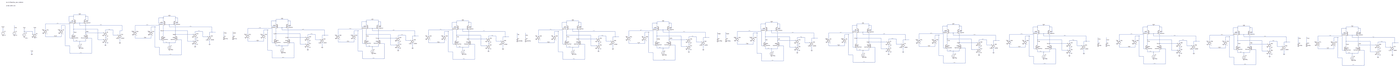
[diagram p0: schematic GmCMaxFlatTrans.asc, whole sheet]
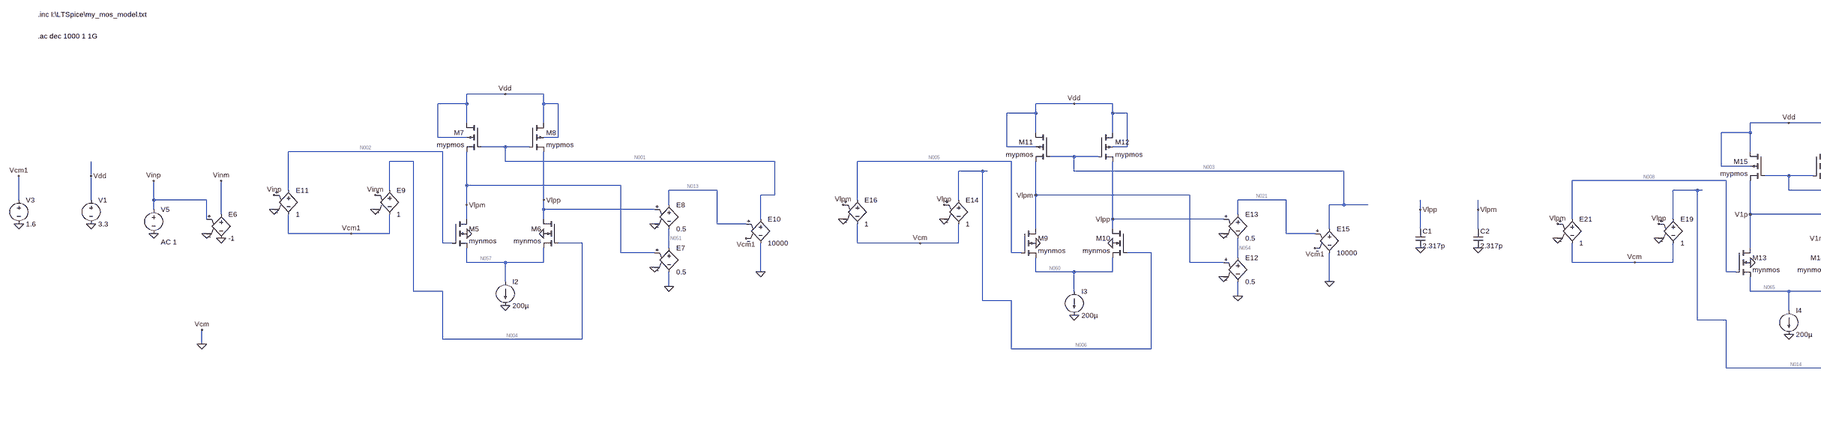
[diagram p1: schematic GmCMaxFlatTrans.asc, part, row 1 of 1, column 1 of 5]
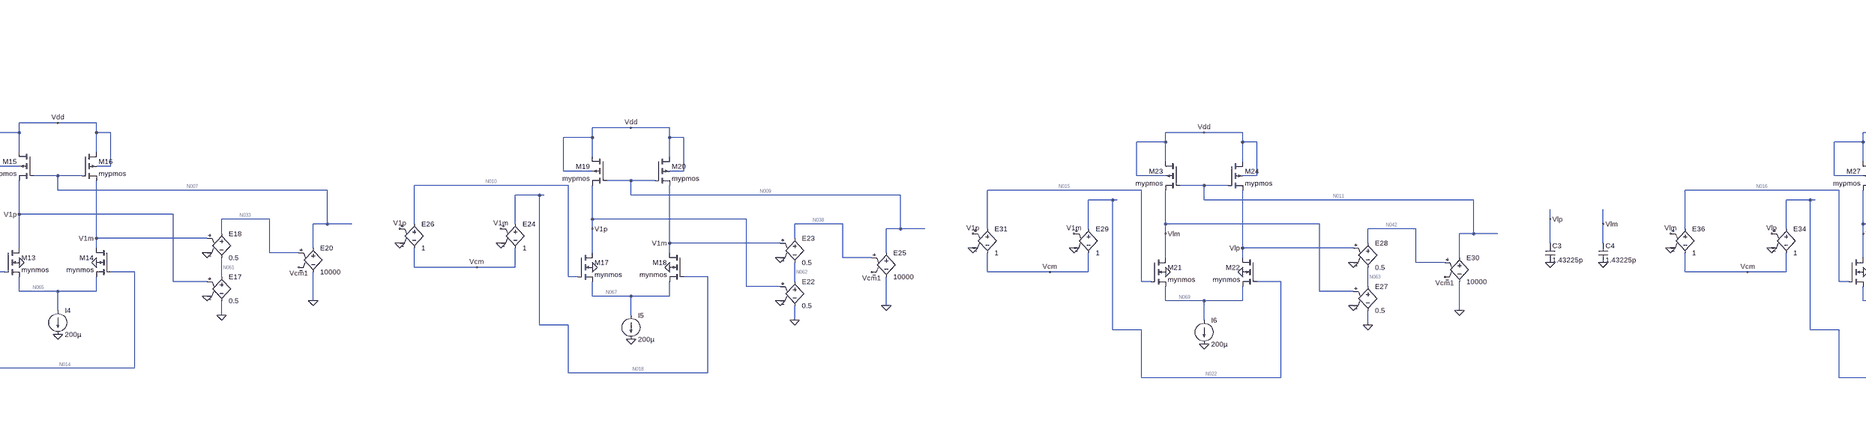
[diagram p2: schematic GmCMaxFlatTrans.asc, part, row 1 of 1, column 2 of 5]
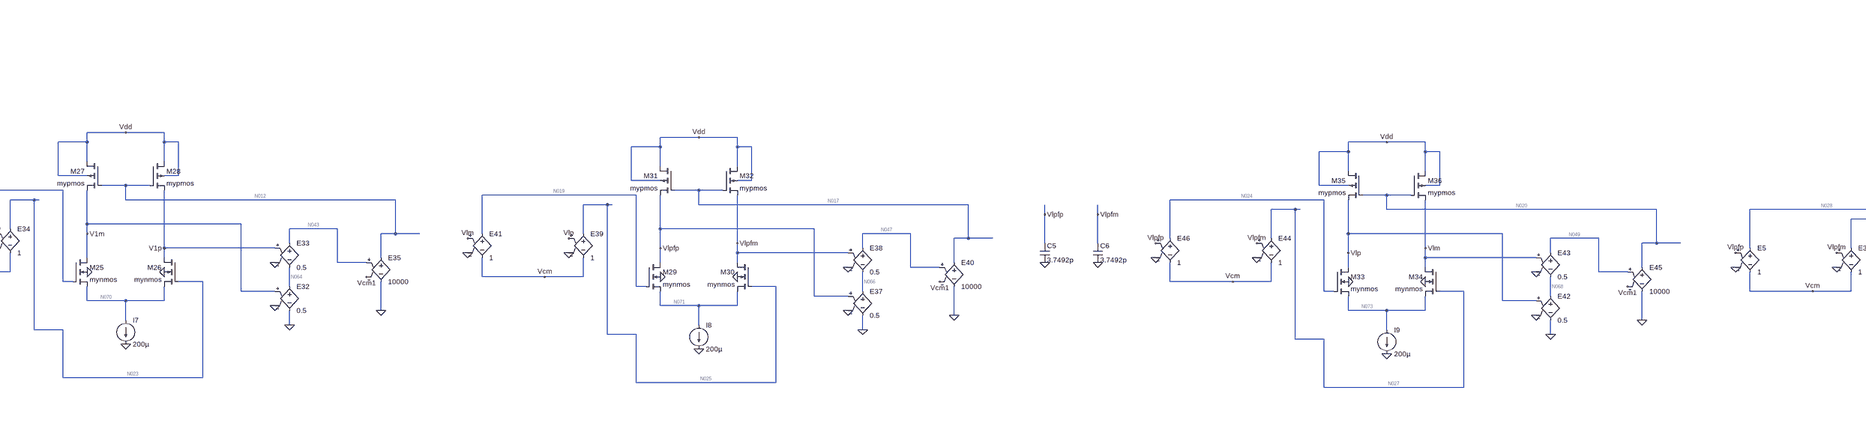
[diagram p3: schematic GmCMaxFlatTrans.asc, part, row 1 of 1, column 3 of 5]
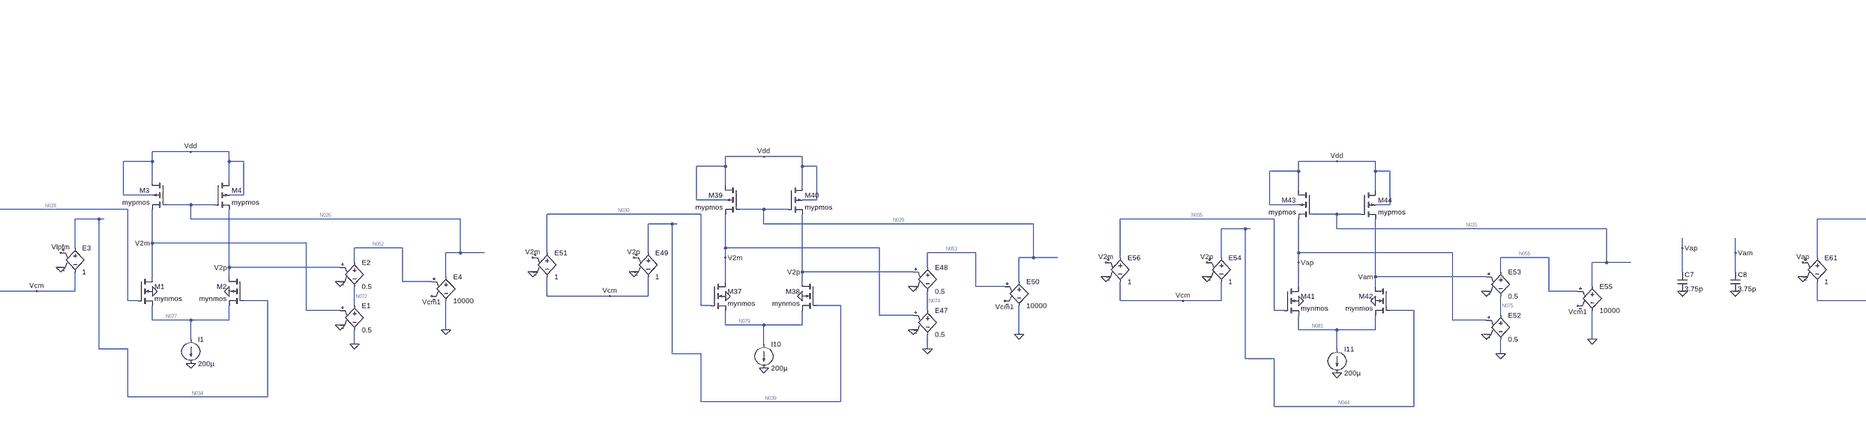
[diagram p4: schematic GmCMaxFlatTrans.asc, part, row 1 of 1, column 4 of 5]
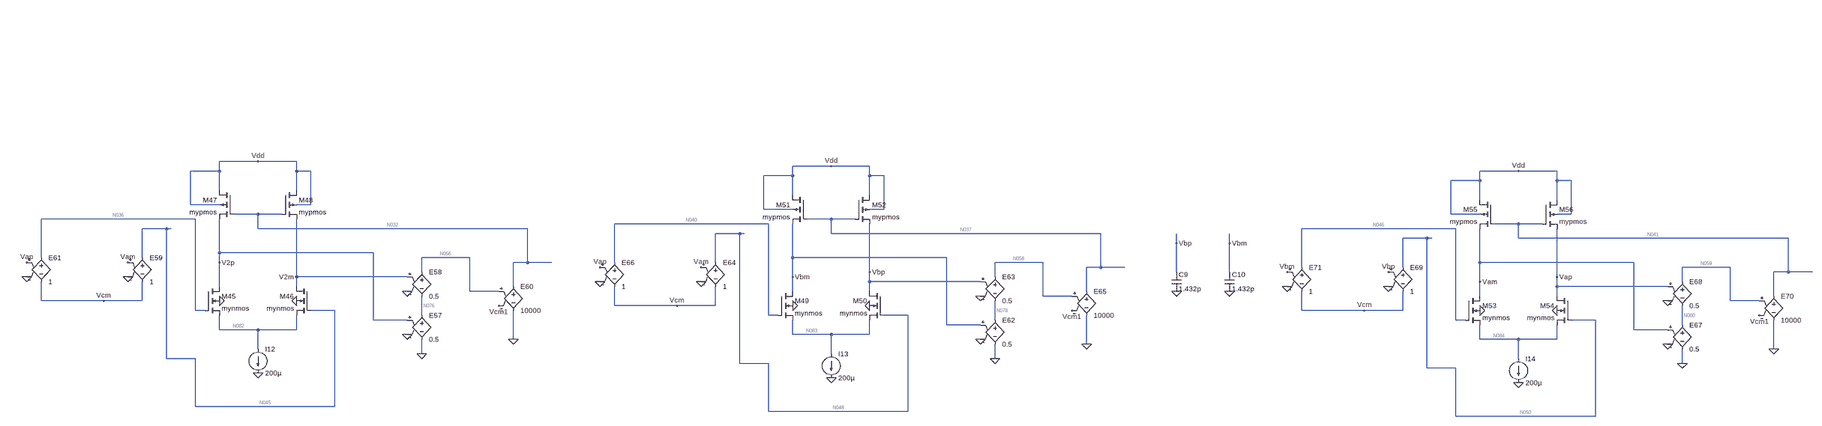
[diagram p5: schematic GmCMaxFlatTrans.asc, part, row 1 of 1, column 5 of 5]
GmCMaxFlatTrans.asc, the LTspice schematic file:
Version 4
SHEET 1 27508 2948
WIRE -672 -288 -800 -288
WIRE -544 -288 -672 -288
WIRE -800 -256 -800 -288
WIRE -800 -256 -896 -256
WIRE -544 -256 -544 -288
WIRE -496 -256 -544 -256
WIRE 1248 -256 1120 -256
WIRE 1376 -256 1248 -256
WIRE 1120 -224 1120 -256
WIRE 1120 -224 1024 -224
WIRE 1376 -224 1376 -256
WIRE 1424 -224 1376 -224
WIRE -800 -192 -800 -256
WIRE -544 -192 -544 -256
WIRE 3744 -192 3616 -192
WIRE 3872 -192 3744 -192
WIRE 5648 -176 5520 -176
WIRE 5776 -176 5648 -176
WIRE 1120 -160 1120 -224
WIRE 1376 -160 1376 -224
WIRE 3616 -160 3616 -192
WIRE 3616 -160 3520 -160
WIRE 3872 -160 3872 -192
WIRE 3920 -160 3872 -160
WIRE 7552 -160 7424 -160
WIRE 7680 -160 7552 -160
WIRE 9952 -160 9824 -160
WIRE 10080 -160 9952 -160
WIRE -896 -144 -896 -256
WIRE -800 -144 -896 -144
WIRE -496 -144 -496 -256
WIRE -496 -144 -544 -144
WIRE 5520 -144 5520 -176
WIRE 5520 -144 5424 -144
WIRE 5776 -144 5776 -176
WIRE 5824 -144 5776 -144
WIRE 11856 -144 11728 -144
WIRE 11984 -144 11856 -144
WIRE 7424 -128 7424 -160
WIRE 7424 -128 7328 -128
WIRE 7680 -128 7680 -160
WIRE 7728 -128 7680 -128
WIRE 9824 -128 9824 -160
WIRE 9824 -128 9728 -128
WIRE 10080 -128 10080 -160
WIRE 10128 -128 10080 -128
WIRE 14144 -128 14016 -128
WIRE 14272 -128 14144 -128
WIRE -672 -112 -752 -112
WIRE -592 -112 -672 -112
WIRE 1024 -112 1024 -224
WIRE 1120 -112 1024 -112
WIRE 1424 -112 1424 -224
WIRE 1424 -112 1376 -112
WIRE 11728 -112 11728 -144
WIRE 11728 -112 11632 -112
WIRE 11984 -112 11984 -144
WIRE 12032 -112 11984 -112
WIRE -880 -96 -1392 -96
WIRE 3616 -96 3616 -160
WIRE 3872 -96 3872 -160
WIRE 14016 -96 14016 -128
WIRE 14016 -96 13920 -96
WIRE 14272 -96 14272 -128
WIRE 14320 -96 14272 -96
WIRE 16128 -96 16000 -96
WIRE 16256 -96 16128 -96
WIRE 1248 -80 1168 -80
WIRE 1328 -80 1248 -80
WIRE 5520 -80 5520 -144
WIRE 5776 -80 5776 -144
WIRE 18032 -80 17904 -80
WIRE 18160 -80 18032 -80
WIRE -976 -64 -1056 -64
WIRE -672 -64 -672 -112
WIRE 224 -64 -672 -64
WIRE 1040 -64 528 -64
WIRE 7424 -64 7424 -128
WIRE 7680 -64 7680 -128
WIRE 9824 -64 9824 -128
WIRE 10080 -64 10080 -128
WIRE 16000 -64 16000 -96
WIRE 16000 -64 15904 -64
WIRE 16256 -64 16256 -96
WIRE 16304 -64 16256 -64
WIRE 19936 -64 19808 -64
WIRE 20064 -64 19936 -64
WIRE 22336 -64 22208 -64
WIRE 22464 -64 22336 -64
WIRE 3520 -48 3520 -160
WIRE 3616 -48 3520 -48
WIRE 3920 -48 3920 -160
WIRE 3920 -48 3872 -48
WIRE 11728 -48 11728 -112
WIRE 11984 -48 11984 -112
WIRE 17904 -48 17904 -80
WIRE 17904 -48 17808 -48
WIRE 18160 -48 18160 -80
WIRE 18208 -48 18160 -48
WIRE 24240 -48 24112 -48
WIRE 24368 -48 24240 -48
WIRE 944 -32 864 -32
WIRE 960 -32 944 -32
WIRE 1248 -32 1248 -80
WIRE 2144 -32 1248 -32
WIRE 5424 -32 5424 -144
WIRE 5520 -32 5424 -32
WIRE 5824 -32 5824 -144
WIRE 5824 -32 5776 -32
WIRE 14016 -32 14016 -96
WIRE 14272 -32 14272 -96
WIRE 19808 -32 19808 -64
WIRE 19808 -32 19712 -32
WIRE 20064 -32 20064 -64
WIRE 20112 -32 20064 -32
WIRE 22208 -32 22208 -64
WIRE 22208 -32 22112 -32
WIRE 22464 -32 22464 -64
WIRE 22512 -32 22464 -32
WIRE 26528 -32 26400 -32
WIRE 26656 -32 26528 -32
WIRE -2048 -16 -2048 -64
WIRE 3744 -16 3664 -16
WIRE 3824 -16 3744 -16
WIRE 7328 -16 7328 -128
WIRE 7424 -16 7328 -16
WIRE 7728 -16 7728 -128
WIRE 7728 -16 7680 -16
WIRE 9728 -16 9728 -128
WIRE 9824 -16 9728 -16
WIRE 10128 -16 10128 -128
WIRE 10128 -16 10080 -16
WIRE 24112 -16 24112 -48
WIRE 24112 -16 24016 -16
WIRE 24368 -16 24368 -48
WIRE 24416 -16 24368 -16
WIRE 3536 0 3024 0
WIRE 5648 0 5568 0
WIRE 5728 0 5648 0
WIRE 11632 0 11632 -112
WIRE 11728 0 11632 0
WIRE 12032 0 12032 -112
WIRE 12032 0 11984 0
WIRE 16000 0 16000 -64
WIRE 16256 0 16256 -64
WIRE 26400 0 26400 -32
WIRE 26400 0 26304 0
WIRE 26656 0 26656 -32
WIRE 26704 0 26656 0
WIRE -800 16 -800 -96
WIRE -288 16 -800 16
WIRE 5440 16 4928 16
WIRE 7552 16 7472 16
WIRE 7632 16 7552 16
WIRE 9952 16 9872 16
WIRE 10032 16 9952 16
WIRE 13920 16 13920 -96
WIRE 14016 16 13920 16
WIRE 14320 16 14320 -96
WIRE 14320 16 14272 16
WIRE 17904 16 17904 -48
WIRE 18160 16 18160 -48
WIRE -1392 32 -1392 -96
WIRE -1056 32 -1056 -64
WIRE 32 32 -128 32
WIRE 3440 32 3360 32
WIRE 3456 32 3440 32
WIRE 3744 32 3744 -16
WIRE 4640 32 3744 32
WIRE 7344 32 6832 32
WIRE 9744 32 9232 32
WIRE 11856 32 11776 32
WIRE 11936 32 11856 32
WIRE 19808 32 19808 -32
WIRE 20064 32 20064 -32
WIRE 22208 32 22208 -32
WIRE 22464 32 22464 -32
WIRE 224 48 224 -64
WIRE 224 48 176 48
WIRE 1120 48 1120 -64
WIRE 1632 48 1120 48
WIRE 5344 48 5264 48
WIRE 5360 48 5344 48
WIRE 5648 48 5648 0
WIRE 6544 48 5648 48
WIRE 11648 48 11136 48
WIRE 14144 48 14064 48
WIRE 14224 48 14144 48
WIRE 15904 48 15904 -64
WIRE 16000 48 15904 48
WIRE 16304 48 16304 -64
WIRE 16304 48 16256 48
WIRE 24112 48 24112 -16
WIRE 24368 48 24368 -16
WIRE -2288 64 -2288 -16
WIRE -2048 64 -2048 -16
WIRE -1840 64 -1840 0
WIRE -1664 64 -1840 64
WIRE -544 64 -544 -96
WIRE 528 64 528 -64
WIRE 864 64 864 -32
WIRE 1952 64 1792 64
WIRE 7248 64 7168 64
WIRE 7264 64 7248 64
WIRE 7552 64 7552 16
WIRE 8448 64 7552 64
WIRE 9648 64 9568 64
WIRE 9664 64 9648 64
WIRE 9952 64 9952 16
WIRE 10848 64 9952 64
WIRE 13936 64 13424 64
WIRE 17808 64 17808 -48
WIRE 17904 64 17808 64
WIRE 18208 64 18208 -48
WIRE 18208 64 18160 64
WIRE 26400 64 26400 0
WIRE 26656 64 26656 0
WIRE -800 80 -800 16
WIRE -128 80 -128 32
WIRE 2144 80 2144 -32
WIRE 2144 80 2096 80
WIRE 2224 80 2144 80
WIRE 11552 80 11472 80
WIRE 11568 80 11552 80
WIRE 11856 80 11856 32
WIRE 12752 80 11856 80
WIRE 16128 80 16048 80
WIRE 16208 80 16128 80
WIRE 19712 80 19712 -32
WIRE 19808 80 19712 80
WIRE 20112 80 20112 -32
WIRE 20112 80 20064 80
WIRE 22112 80 22112 -32
WIRE 22208 80 22112 80
WIRE 22512 80 22512 -32
WIRE 22512 80 22464 80
WIRE -1840 96 -1840 64
WIRE -544 96 -544 64
WIRE -176 96 -544 96
WIRE 2480 96 2480 64
WIRE 2672 96 2672 64
WIRE 13840 96 13760 96
WIRE 13856 96 13840 96
WIRE 14144 96 14144 48
WIRE 15040 96 14144 96
WIRE 15920 96 15408 96
WIRE 18032 96 17952 96
WIRE 18112 96 18032 96
WIRE 24016 96 24016 -16
WIRE 24112 96 24016 96
WIRE 24416 96 24416 -16
WIRE 24416 96 24368 96
WIRE -1616 112 -1616 0
WIRE 1792 112 1792 64
WIRE 3616 112 3616 0
WIRE 4128 112 3616 112
WIRE 13008 112 13008 80
WIRE 13184 112 13184 80
WIRE 17824 112 17312 112
WIRE 19936 112 19856 112
WIRE 20016 112 19936 112
WIRE 22336 112 22256 112
WIRE 22416 112 22336 112
WIRE 26304 112 26304 0
WIRE 26400 112 26304 112
WIRE 26704 112 26704 0
WIRE 26704 112 26656 112
WIRE -1664 128 -1664 64
WIRE -800 128 -800 80
WIRE -544 128 -544 96
WIRE 176 128 176 48
WIRE 1376 128 1376 -64
WIRE 1744 128 1376 128
WIRE 3024 128 3024 0
WIRE 3360 128 3360 32
WIRE 4448 128 4288 128
WIRE 5520 128 5520 16
WIRE 6032 128 5520 128
WIRE 8784 128 8784 96
WIRE 15824 128 15744 128
WIRE 15840 128 15824 128
WIRE 16128 128 16128 80
WIRE 17024 128 16128 128
WIRE 19728 128 19216 128
WIRE 22128 128 21616 128
WIRE 24240 128 24160 128
WIRE 24320 128 24240 128
WIRE 32 144 32 32
WIRE 128 144 32 144
WIRE 4640 144 4640 32
WIRE 4640 144 4592 144
WIRE 4720 144 4640 144
WIRE 4928 144 4928 16
WIRE 5264 144 5264 48
WIRE 6352 144 6192 144
WIRE 7424 144 7424 32
WIRE 7936 144 7424 144
WIRE 8960 144 8960 96
WIRE 9824 144 9824 32
WIRE 10336 144 9824 144
WIRE 17728 144 17648 144
WIRE 17744 144 17728 144
WIRE 18032 144 18032 96
WIRE 18928 144 18032 144
WIRE 24032 144 23520 144
WIRE 26528 144 26448 144
WIRE 26608 144 26528 144
WIRE 1120 160 1120 48
WIRE 1376 160 1376 128
WIRE 2096 160 2096 80
WIRE 2480 160 2480 96
WIRE 2672 160 2672 96
WIRE 5520 160 5520 128
WIRE 6544 160 6544 48
WIRE 6544 160 6496 160
WIRE 6624 160 6544 160
WIRE 6832 160 6832 32
WIRE 7168 160 7168 64
WIRE 8256 160 8096 160
WIRE 9232 160 9232 32
WIRE 9568 160 9568 64
WIRE 10656 160 10496 160
WIRE 11728 160 11728 48
WIRE 12240 160 11728 160
WIRE 19632 160 19552 160
WIRE 19648 160 19632 160
WIRE 19936 160 19936 112
WIRE 20832 160 19936 160
WIRE 22032 160 21952 160
WIRE 22048 160 22032 160
WIRE 22336 160 22336 112
WIRE 23232 160 22336 160
WIRE 26320 160 25808 160
WIRE -1392 176 -1392 112
WIRE -1184 176 -1392 176
WIRE -1056 176 -1056 112
WIRE -1056 176 -1184 176
WIRE 1952 176 1952 64
WIRE 2048 176 1952 176
WIRE 4288 176 4288 128
WIRE 7424 176 7424 144
WIRE 8448 176 8448 64
WIRE 8448 176 8400 176
WIRE 8528 176 8448 176
WIRE 9824 176 9824 144
WIRE 10848 176 10848 64
WIRE 10848 176 10800 176
WIRE 10928 176 10848 176
WIRE 11136 176 11136 48
WIRE 11472 176 11472 80
WIRE 12560 176 12400 176
WIRE 14016 176 14016 64
WIRE 14528 176 14016 176
WIRE 23936 176 23856 176
WIRE 23952 176 23936 176
WIRE 24240 176 24240 128
WIRE 25136 176 24240 176
WIRE 3872 192 3872 0
WIRE 4240 192 3872 192
WIRE 6192 192 6192 144
WIRE 12752 192 12752 80
WIRE 12752 192 12704 192
WIRE 12832 192 12752 192
WIRE 13424 192 13424 64
WIRE 13760 192 13760 96
WIRE 14848 192 14688 192
WIRE 26224 192 26144 192
WIRE 26240 192 26224 192
WIRE 26528 192 26528 144
WIRE 27424 192 26528 192
WIRE -880 208 -880 -96
WIRE -848 208 -880 208
WIRE -416 208 -496 208
WIRE 528 208 528 144
WIRE 736 208 528 208
WIRE 864 208 864 144
WIRE 864 208 736 208
WIRE 5776 208 5776 16
WIRE 6144 208 5776 208
WIRE 8096 208 8096 160
WIRE 8784 208 8784 128
WIRE 8960 208 8960 144
WIRE 10496 208 10496 160
WIRE 11984 208 11984 48
WIRE 13008 208 13008 112
WIRE 13184 208 13184 112
WIRE 15040 208 15040 96
WIRE 15040 208 14992 208
WIRE 15120 208 15040 208
WIRE 16000 208 16000 96
WIRE 16512 208 16000 208
WIRE 25392 208 25392 176
WIRE 25568 208 25568 176
WIRE -128 224 -128 160
WIRE 3616 224 3616 112
WIRE 3872 224 3872 192
WIRE 4592 224 4592 144
WIRE 7680 224 7680 32
WIRE 8048 224 7680 224
WIRE 10080 224 10080 32
WIRE 10448 224 10080 224
WIRE 11728 224 11728 160
WIRE 12400 224 12400 176
WIRE 14272 224 14272 64
WIRE 15408 224 15408 96
WIRE 15744 224 15744 128
WIRE 16832 224 16672 224
WIRE 17904 224 17904 112
WIRE 18416 224 17904 224
WIRE 21168 224 21168 192
WIRE -288 240 -288 16
WIRE -176 240 -288 240
WIRE 1040 240 1040 -64
WIRE 1072 240 1040 240
WIRE 1504 240 1424 240
WIRE 4448 240 4448 128
WIRE 4544 240 4448 240
WIRE 5520 240 5520 160
WIRE 5776 240 5776 208
WIRE 6496 240 6496 160
WIRE 11984 240 11984 208
WIRE 12352 240 11984 240
WIRE 14016 240 14016 176
WIRE 14688 240 14688 192
WIRE 17024 240 17024 128
WIRE 17024 240 16976 240
WIRE 17104 240 17024 240
WIRE 17312 240 17312 112
WIRE 17648 240 17648 144
WIRE 18736 240 18576 240
WIRE 19808 240 19808 128
WIRE 20320 240 19808 240
WIRE 21344 240 21344 192
WIRE 22208 240 22208 128
WIRE 22720 240 22208 240
WIRE 1792 256 1792 192
WIRE 6352 256 6352 144
WIRE 6448 256 6352 256
WIRE 7424 256 7424 176
WIRE 7680 256 7680 224
WIRE 8400 256 8400 176
WIRE 9824 256 9824 176
WIRE 10080 256 10080 224
WIRE 10800 256 10800 176
WIRE 14272 256 14272 224
WIRE 14640 256 14272 256
WIRE 17904 256 17904 224
WIRE 18928 256 18928 144
WIRE 18928 256 18880 256
WIRE 19008 256 18928 256
WIRE 19216 256 19216 128
WIRE 19552 256 19552 160
WIRE 20640 256 20480 256
WIRE 21616 256 21616 128
WIRE 21952 256 21952 160
WIRE 23040 256 22880 256
WIRE 24112 256 24112 144
WIRE 24624 256 24112 256
WIRE -800 272 -800 224
WIRE -672 272 -800 272
WIRE -544 272 -544 224
WIRE -544 272 -672 272
WIRE 1632 272 1632 48
WIRE 1744 272 1632 272
WIRE 3024 272 3024 208
WIRE 3232 272 3024 272
WIRE 3360 272 3360 208
WIRE 3360 272 3232 272
WIRE 8256 272 8256 160
WIRE 8352 272 8256 272
WIRE 10656 272 10656 160
WIRE 10752 272 10656 272
WIRE 11728 272 11728 224
WIRE 11984 272 11984 240
WIRE 12704 272 12704 192
WIRE 16672 272 16672 224
WIRE 19808 272 19808 240
WIRE 20832 272 20832 160
WIRE 20832 272 20784 272
WIRE 20912 272 20832 272
WIRE 22208 272 22208 240
WIRE 23232 272 23232 160
WIRE 23232 272 23184 272
WIRE 23312 272 23232 272
WIRE 23520 272 23520 144
WIRE 23856 272 23856 176
WIRE 24944 272 24784 272
WIRE 26400 272 26400 160
WIRE 26912 272 26400 272
WIRE 4928 288 4928 224
WIRE 5136 288 4928 288
WIRE 5264 288 5264 224
WIRE 5264 288 5136 288
WIRE 12560 288 12560 176
WIRE 12656 288 12560 288
WIRE 14016 288 14016 240
WIRE 14272 288 14272 256
WIRE 14992 288 14992 208
WIRE 16256 288 16256 96
WIRE 16624 288 16256 288
WIRE 18576 288 18576 240
WIRE 25136 288 25136 176
WIRE 25136 288 25088 288
WIRE 25216 288 25136 288
WIRE 25808 288 25808 160
WIRE 26144 288 26144 192
WIRE 27232 288 27072 288
WIRE 176 304 176 208
WIRE 1120 304 1120 256
WIRE 1248 304 1120 304
WIRE 1376 304 1376 256
WIRE 1376 304 1248 304
WIRE 3536 304 3536 0
WIRE 3568 304 3536 304
WIRE 4000 304 3920 304
WIRE 6832 304 6832 240
WIRE 7040 304 6832 304
WIRE 7168 304 7168 240
WIRE 7168 304 7040 304
WIRE 9232 304 9232 240
WIRE 9440 304 9232 304
WIRE 9568 304 9568 240
WIRE 9568 304 9440 304
WIRE 14848 304 14848 192
WIRE 14944 304 14848 304
WIRE 18160 304 18160 112
WIRE 18528 304 18160 304
WIRE 20480 304 20480 256
WIRE 21168 304 21168 224
WIRE 21344 304 21344 240
WIRE 22880 304 22880 256
WIRE 24368 304 24368 144
WIRE 25392 304 25392 208
WIRE 25568 304 25568 208
WIRE 27424 304 27424 192
WIRE 27424 304 27376 304
WIRE 27504 304 27424 304
WIRE 4288 320 4288 256
WIRE 5440 320 5440 16
WIRE 5472 320 5440 320
WIRE 5904 320 5824 320
WIRE 11136 320 11136 256
WIRE 11344 320 11136 320
WIRE 11472 320 11472 256
WIRE 11472 320 11344 320
WIRE 16000 320 16000 208
WIRE 16256 320 16256 288
WIRE 16976 320 16976 240
WIRE 20064 320 20064 128
WIRE 20432 320 20064 320
WIRE 22464 320 22464 128
WIRE 22832 320 22464 320
WIRE 24112 320 24112 256
WIRE 24784 320 24784 272
WIRE 26656 320 26656 160
WIRE -672 336 -672 272
WIRE 2096 336 2096 240
WIRE 4128 336 4128 112
WIRE 4240 336 4128 336
WIRE 6192 336 6192 272
WIRE 7344 336 7344 32
WIRE 7376 336 7344 336
WIRE 7808 336 7728 336
WIRE 9744 336 9744 32
WIRE 9776 336 9744 336
WIRE 10208 336 10128 336
WIRE 13424 336 13424 272
WIRE 13632 336 13424 336
WIRE 13760 336 13760 272
WIRE 13760 336 13632 336
WIRE 16832 336 16832 224
WIRE 16928 336 16832 336
WIRE 17904 336 17904 256
WIRE 18160 336 18160 304
WIRE 18880 336 18880 256
WIRE 24368 336 24368 304
WIRE 24736 336 24368 336
WIRE 26400 336 26400 272
WIRE 27072 336 27072 288
WIRE -128 352 -128 304
WIRE 6032 352 6032 128
WIRE 6144 352 6032 352
WIRE 8096 352 8096 288
WIRE 10496 352 10496 288
WIRE 11648 352 11648 48
WIRE 11680 352 11648 352
WIRE 12112 352 12032 352
WIRE 18736 352 18736 240
WIRE 18832 352 18736 352
WIRE 19808 352 19808 272
WIRE 20064 352 20064 320
WIRE 20784 352 20784 272
WIRE 22208 352 22208 272
WIRE 22464 352 22464 320
WIRE 23184 352 23184 272
WIRE 26656 352 26656 320
WIRE 27024 352 26656 352
WIRE -976 368 -976 -64
WIRE -880 368 -976 368
WIRE 1248 368 1248 304
WIRE 3616 368 3616 320
WIRE 3744 368 3616 368
WIRE 3872 368 3872 320
WIRE 3872 368 3744 368
WIRE 7936 368 7936 144
WIRE 8048 368 7936 368
WIRE 10336 368 10336 144
WIRE 10448 368 10336 368
WIRE 12400 368 12400 304
WIRE 13936 368 13936 64
WIRE 13968 368 13936 368
WIRE 14400 368 14320 368
WIRE 15408 368 15408 304
WIRE 15616 368 15408 368
WIRE 15744 368 15744 304
WIRE 15744 368 15616 368
WIRE 20640 368 20640 256
WIRE 20736 368 20640 368
WIRE 23040 368 23040 256
WIRE 23136 368 23040 368
WIRE 24112 368 24112 320
WIRE 24368 368 24368 336
WIRE 25088 368 25088 288
WIRE 1792 384 1792 336
WIRE 5520 384 5520 336
WIRE 5648 384 5520 384
WIRE 5776 384 5776 336
WIRE 5776 384 5648 384
WIRE 12240 384 12240 160
WIRE 12352 384 12240 384
WIRE 14688 384 14688 320
WIRE 17312 384 17312 320
WIRE 17520 384 17312 384
WIRE 17648 384 17648 320
WIRE 17648 384 17520 384
WIRE 24944 384 24944 272
WIRE 25040 384 24944 384
WIRE 26400 384 26400 336
WIRE 26656 384 26656 352
WIRE 27376 384 27376 304
WIRE 944 400 944 -32
WIRE 1040 400 944 400
WIRE 4592 400 4592 304
WIRE 7424 400 7424 352
WIRE 7552 400 7424 400
WIRE 7680 400 7680 352
WIRE 7680 400 7552 400
WIRE 9824 400 9824 352
WIRE 9952 400 9824 400
WIRE 10080 400 10080 352
WIRE 10080 400 9952 400
WIRE 14528 400 14528 176
WIRE 14640 400 14528 400
WIRE 15920 400 15920 96
WIRE 15952 400 15920 400
WIRE 16384 400 16304 400
WIRE 19216 400 19216 336
WIRE 19424 400 19216 400
WIRE 19552 400 19552 336
WIRE 19552 400 19424 400
WIRE 21616 400 21616 336
WIRE 21824 400 21616 400
WIRE 21952 400 21952 336
WIRE 21952 400 21824 400
WIRE 27232 400 27232 288
WIRE 27328 400 27232 400
WIRE 6496 416 6496 320
WIRE 11728 416 11728 368
WIRE 11856 416 11728 416
WIRE 11984 416 11984 368
WIRE 11984 416 11856 416
WIRE 16672 416 16672 352
WIRE 17824 416 17824 112
WIRE 17856 416 17824 416
WIRE 18288 416 18208 416
WIRE 23520 416 23520 352
WIRE 23728 416 23520 416
WIRE 23856 416 23856 352
WIRE 23856 416 23728 416
WIRE 3744 432 3744 368
WIRE 8400 432 8400 336
WIRE 10800 432 10800 336
WIRE 14016 432 14016 384
WIRE 14144 432 14016 432
WIRE 14272 432 14272 384
WIRE 14272 432 14144 432
WIRE 16512 432 16512 208
WIRE 16624 432 16512 432
WIRE 18576 432 18576 368
WIRE 19728 432 19728 128
WIRE 19760 432 19728 432
WIRE 20192 432 20112 432
WIRE 22128 432 22128 128
WIRE 22160 432 22128 432
WIRE 22592 432 22512 432
WIRE 25808 432 25808 368
WIRE 26016 432 25808 432
WIRE 26144 432 26144 368
WIRE 26144 432 26016 432
WIRE 4288 448 4288 400
WIRE 5648 448 5648 384
WIRE 12704 448 12704 352
WIRE 18416 448 18416 224
WIRE 18528 448 18416 448
WIRE 20480 448 20480 384
WIRE 22880 448 22880 384
WIRE 24032 448 24032 144
WIRE 24064 448 24032 448
WIRE 24496 448 24416 448
WIRE 3440 464 3440 32
WIRE 3536 464 3440 464
WIRE 6192 464 6192 416
WIRE 7552 464 7552 400
WIRE 9952 464 9952 400
WIRE 14992 464 14992 368
WIRE 16000 464 16000 416
WIRE 16128 464 16000 464
WIRE 16256 464 16256 416
WIRE 16256 464 16128 464
WIRE 20320 464 20320 240
WIRE 20432 464 20320 464
WIRE 22720 464 22720 240
WIRE 22832 464 22720 464
WIRE 24784 464 24784 400
WIRE 26320 464 26320 160
WIRE 26352 464 26320 464
WIRE 26784 464 26704 464
WIRE 5344 480 5344 48
WIRE 5440 480 5344 480
WIRE 8096 480 8096 432
WIRE 10496 480 10496 432
WIRE 11856 480 11856 416
WIRE 17904 480 17904 432
WIRE 18032 480 17904 480
WIRE 18160 480 18160 432
WIRE 18160 480 18032 480
WIRE 24624 480 24624 256
WIRE 24736 480 24624 480
WIRE 27072 480 27072 416
WIRE 7248 496 7248 64
WIRE 7344 496 7248 496
WIRE 9648 496 9648 64
WIRE 9744 496 9648 496
WIRE 12400 496 12400 448
WIRE 14144 496 14144 432
WIRE 16976 496 16976 400
WIRE 19808 496 19808 448
WIRE 19936 496 19808 496
WIRE 20064 496 20064 448
WIRE 20064 496 19936 496
WIRE 22208 496 22208 448
WIRE 22336 496 22208 496
WIRE 22464 496 22464 448
WIRE 22464 496 22336 496
WIRE 26912 496 26912 272
WIRE 27024 496 26912 496
WIRE 11552 512 11552 80
WIRE 11648 512 11552 512
WIRE 14688 512 14688 464
WIRE 18880 512 18880 416
WIRE 24112 512 24112 464
WIRE 24240 512 24112 512
WIRE 24368 512 24368 464
WIRE 24368 512 24240 512
WIRE -880 528 -880 368
WIRE -416 528 -416 208
WIRE -416 528 -880 528
WIRE 13840 528 13840 96
WIRE 13936 528 13840 528
WIRE 16128 528 16128 464
WIRE 20784 528 20784 432
WIRE 23184 528 23184 432
WIRE 26400 528 26400 480
WIRE 26528 528 26400 528
WIRE 26656 528 26656 480
WIRE 26656 528 26528 528
WIRE -1680 544 -1680 496
WIRE 16672 544 16672 496
WIRE 18032 544 18032 480
WIRE 25088 544 25088 448
WIRE 1040 560 1040 400
WIRE 1504 560 1504 240
WIRE 1504 560 1040 560
WIRE 15824 560 15824 128
WIRE 15920 560 15824 560
WIRE 18576 560 18576 512
WIRE 19936 560 19936 496
WIRE 22336 560 22336 496
WIRE 27376 560 27376 464
WIRE 17728 576 17728 144
WIRE 17824 576 17728 576
WIRE 20480 576 20480 528
WIRE 22880 576 22880 528
WIRE 24240 576 24240 512
WIRE 19632 592 19632 160
WIRE 19728 592 19632 592
WIRE 22032 592 22032 160
WIRE 22128 592 22032 592
WIRE 24784 592 24784 544
WIRE 26528 592 26528 528
WIRE 23936 608 23936 176
WIRE 24032 608 23936 608
WIRE 27072 608 27072 560
WIRE 3536 624 3536 464
WIRE 4000 624 4000 304
WIRE 4000 624 3536 624
WIRE 26224 624 26224 192
WIRE 26320 624 26224 624
WIRE 5440 640 5440 480
WIRE 5904 640 5904 320
WIRE 5904 640 5440 640
WIRE 7344 656 7344 496
WIRE 7808 656 7808 336
WIRE 7808 656 7344 656
WIRE 9744 656 9744 496
WIRE 10208 656 10208 336
WIRE 10208 656 9744 656
WIRE 11648 672 11648 512
WIRE 12112 672 12112 352
WIRE 12112 672 11648 672
WIRE 13936 688 13936 528
WIRE 14400 688 14400 368
WIRE 14400 688 13936 688
WIRE 15920 720 15920 560
WIRE 16384 720 16384 400
WIRE 16384 720 15920 720
WIRE 17824 736 17824 576
WIRE 18288 736 18288 416
WIRE 18288 736 17824 736
WIRE 19728 752 19728 592
WIRE 20192 752 20192 432
WIRE 20192 752 19728 752
WIRE 22128 752 22128 592
WIRE 22592 752 22592 432
WIRE 22592 752 22128 752
WIRE 24032 768 24032 608
WIRE 24496 768 24496 448
WIRE 24496 768 24032 768
WIRE 26320 784 26320 624
WIRE 26784 784 26784 464
WIRE 26784 784 26320 784
FLAG -1840 176 0
FLAG -1616 192 0
FLAG -1664 176 0
FLAG -1840 0 Vinp
FLAG -1616 0 Vinm
FLAG -672 -288 Vdd
FLAG -176 288 0
FLAG -176 144 0
FLAG -128 352 0
FLAG 176 304 0
FLAG -800 176 0
FLAG -544 176 0
FLAG 128 192 Vcm1
FLAG -672 416 0
FLAG -1440 96 0
FLAG -1104 96 0
FLAG -1440 48 Vinp
FLAG -1104 48 Vinm
FLAG -544 64 Vlpp
FLAG -800 80 Vlpm
FLAG 1248 -256 Vdd
FLAG 1744 320 0
FLAG 1744 176 0
FLAG 1792 384 0
FLAG 2096 336 0
FLAG 736 208 Vcm
FLAG 1120 208 0
FLAG 1376 208 0
FLAG 2048 224 Vcm1
FLAG 1248 448 0
FLAG 480 128 0
FLAG 816 128 0
FLAG 480 80 Vlpm
FLAG 816 80 Vlpp
FLAG 1120 48 Vlpm
FLAG 1376 128 Vlpp
FLAG 2480 224 0
FLAG 2480 96 Vlpp
FLAG 2672 224 0
FLAG 2672 96 Vlpm
FLAG 3744 -192 Vdd
FLAG 4240 384 0
FLAG 4240 240 0
FLAG 4288 448 0
FLAG 4592 400 0
FLAG 3232 272 Vcm
FLAG 3616 272 0
FLAG 3872 272 0
FLAG 4544 288 Vcm1
FLAG 3744 512 0
FLAG 2976 192 0
FLAG 3312 192 0
FLAG 2976 144 Vlpm
FLAG 3312 144 Vlpp
FLAG 3872 192 V1m
FLAG 3616 112 V1p
FLAG 5648 -176 Vdd
FLAG 6144 400 0
FLAG 6144 256 0
FLAG 6192 464 0
FLAG 6496 416 0
FLAG 5136 288 Vcm
FLAG 5520 288 0
FLAG 5776 288 0
FLAG 6448 304 Vcm1
FLAG 5648 528 0
FLAG 4880 208 0
FLAG 5216 208 0
FLAG 4880 160 V1p
FLAG 5216 160 V1m
FLAG 5520 160 V1p
FLAG 5776 208 V1m
FLAG 7552 -160 Vdd
FLAG 8048 416 0
FLAG 8048 272 0
FLAG 8096 480 0
FLAG 8400 432 0
FLAG 7040 304 Vcm
FLAG 7424 304 0
FLAG 7680 304 0
FLAG 8352 320 Vcm1
FLAG 7552 544 0
FLAG 6784 224 0
FLAG 7120 224 0
FLAG 6784 176 V1p
FLAG 7120 176 V1m
FLAG 7424 176 Vlm
FLAG 7680 224 Vlp
FLAG 8784 272 0
FLAG 8960 272 0
FLAG 8784 128 Vlp
FLAG 8960 144 Vlm
FLAG 9952 -160 Vdd
FLAG 10448 416 0
FLAG 10448 272 0
FLAG 10496 480 0
FLAG 10800 432 0
FLAG 9440 304 Vcm
FLAG 9824 304 0
FLAG 10080 304 0
FLAG 10752 320 Vcm1
FLAG 9952 544 0
FLAG 9184 224 0
FLAG 9520 224 0
FLAG 9824 176 V1m
FLAG 10080 224 V1p
FLAG 9184 176 Vlm
FLAG 9520 176 Vlp
FLAG 11856 -144 Vdd
FLAG 12352 432 0
FLAG 12352 288 0
FLAG 12400 496 0
FLAG 12704 448 0
FLAG 11344 320 Vcm
FLAG 11728 320 0
FLAG 11984 320 0
FLAG 12656 336 Vcm1
FLAG 11856 560 0
FLAG 11088 240 0
FLAG 11424 240 0
FLAG 11088 192 Vlm
FLAG 11424 192 Vlp
FLAG 11728 224 Vlpfp
FLAG 11984 208 Vlpfm
FLAG 13008 272 0
FLAG 13184 272 0
FLAG 13008 112 Vlpfp
FLAG 13184 112 Vlpfm
FLAG 14144 -128 Vdd
FLAG 14640 448 0
FLAG 14640 304 0
FLAG 14688 512 0
FLAG 14992 464 0
FLAG 13632 336 Vcm
FLAG 14016 336 0
FLAG 14272 336 0
FLAG 14944 352 Vcm1
FLAG 14144 576 0
FLAG 13376 256 0
FLAG 13712 256 0
FLAG 13376 208 Vlpfp
FLAG 13712 208 Vlpfm
FLAG 14016 240 Vlp
FLAG 14272 224 Vlm
FLAG -2048 144 0
FLAG -2048 -16 Vdd
FLAG -2288 144 0
FLAG -1680 544 0
FLAG -1680 496 Vcm
FLAG -1184 176 Vcm1
FLAG -2288 -16 Vcm1
FLAG 16128 -96 Vdd
FLAG 16624 480 0
FLAG 16624 336 0
FLAG 16672 544 0
FLAG 16976 496 0
FLAG 15616 368 Vcm
FLAG 16000 368 0
FLAG 16256 368 0
FLAG 16928 384 Vcm1
FLAG 16128 608 0
FLAG 15360 288 0
FLAG 15696 288 0
FLAG 15360 240 Vlpfp
FLAG 15696 240 Vlpfm
FLAG 16256 288 V2p
FLAG 16000 208 V2m
FLAG 18032 -80 Vdd
FLAG 18528 496 0
FLAG 18528 352 0
FLAG 18576 560 0
FLAG 18880 512 0
FLAG 17520 384 Vcm
FLAG 17904 384 0
FLAG 18160 384 0
FLAG 18832 400 Vcm1
FLAG 18032 624 0
FLAG 17264 304 0
FLAG 17600 304 0
FLAG 17264 256 V2m
FLAG 17600 256 V2p
FLAG 17904 256 V2m
FLAG 18160 304 V2p
FLAG 19936 -64 Vdd
FLAG 20432 512 0
FLAG 20432 368 0
FLAG 20480 576 0
FLAG 20784 528 0
FLAG 19424 400 Vcm
FLAG 19808 400 0
FLAG 20064 400 0
FLAG 20736 416 Vcm1
FLAG 19936 640 0
FLAG 19168 320 0
FLAG 19504 320 0
FLAG 19168 272 V2m
FLAG 19504 272 V2p
FLAG 19808 272 Vap
FLAG 20064 320 Vam
FLAG 21168 368 0
FLAG 21344 368 0
FLAG 21168 224 Vap
FLAG 21344 240 Vam
FLAG 22336 -64 Vdd
FLAG 22832 512 0
FLAG 22832 368 0
FLAG 22880 576 0
FLAG 23184 528 0
FLAG 21824 400 Vcm
FLAG 22208 400 0
FLAG 22464 400 0
FLAG 23136 416 Vcm1
FLAG 22336 640 0
FLAG 21568 320 0
FLAG 21904 320 0
FLAG 22208 272 V2p
FLAG 22464 320 V2m
FLAG 21568 272 Vap
FLAG 21904 272 Vam
FLAG 24240 -48 Vdd
FLAG 24736 528 0
FLAG 24736 384 0
FLAG 24784 592 0
FLAG 25088 544 0
FLAG 23728 416 Vcm
FLAG 24112 416 0
FLAG 24368 416 0
FLAG 25040 432 Vcm1
FLAG 24240 656 0
FLAG 23472 336 0
FLAG 23808 336 0
FLAG 23472 288 Vap
FLAG 23808 288 Vam
FLAG 24112 320 Vbm
FLAG 24368 304 Vbp
FLAG 25392 368 0
FLAG 25568 368 0
FLAG 25392 208 Vbp
FLAG 25568 208 Vbm
FLAG 26528 -32 Vdd
FLAG 27024 544 0
FLAG 27024 400 0
FLAG 27072 608 0
FLAG 27376 560 0
FLAG 26016 432 Vcm
FLAG 26400 432 0
FLAG 26656 432 0
FLAG 27328 448 Vcm1
FLAG 26528 672 0
FLAG 25760 352 0
FLAG 26096 352 0
FLAG 25760 304 Vbm
FLAG 26096 304 Vbp
FLAG 26400 336 Vam
FLAG 26656 320 Vap
SYMBOL voltage -1840 80 R0
WINDOW 123 24 124 Left 2
WINDOW 39 0 0 Left 2
SYMATTR Value2 AC 1
SYMATTR InstName V5
SYMATTR Value ""
SYMBOL e -1616 96 R0
SYMATTR InstName E6
SYMATTR Value -1
SYMBOL nmos4 -848 128 R0
SYMATTR InstName M5
SYMATTR Value mynmos
SYMATTR Value2 l=0.5u w=4.05u m=4
SYMBOL nmos4 -496 128 M0
SYMATTR InstName M6
SYMATTR Value mynmos
SYMATTR Value2 l=0.5u w=4.05u m=4
SYMBOL pmos4 -752 -192 M0
SYMATTR InstName M7
SYMATTR Value mypmos
SYMATTR Value2 l=0.5u w=4.05u m=14
SYMBOL pmos4 -592 -192 R0
SYMATTR InstName M8
SYMATTR Value mypmos
SYMATTR Value2 l=0.5u w=4.05u m=14
SYMBOL e -128 208 R0
SYMATTR InstName E7
SYMATTR Value 0.5
SYMBOL e -128 64 R0
SYMATTR InstName E8
SYMATTR Value 0.5
SYMBOL e -1056 16 R0
SYMATTR InstName E9
SYMATTR Value 1
SYMBOL current -672 336 R0
WINDOW 123 0 0 Left 2
WINDOW 39 0 0 Left 2
SYMATTR InstName I2
SYMATTR Value 200µ
SYMBOL e 176 112 R0
SYMATTR InstName E10
SYMATTR Value 10000
SYMBOL e -1392 16 R0
SYMATTR InstName E11
SYMATTR Value 1
SYMBOL nmos4 1072 160 R0
SYMATTR InstName M9
SYMATTR Value mynmos
SYMATTR Value2 l=0.5u w=4.05u m=4
SYMBOL nmos4 1424 160 M0
SYMATTR InstName M10
SYMATTR Value mynmos
SYMATTR Value2 l=0.5u w=4.05u m=4
SYMBOL pmos4 1168 -160 M0
SYMATTR InstName M11
SYMATTR Value mypmos
SYMATTR Value2 l=0.5u w=4.05u m=14
SYMBOL pmos4 1328 -160 R0
SYMATTR InstName M12
SYMATTR Value mypmos
SYMATTR Value2 l=0.5u w=4.05u m=14
SYMBOL e 1792 240 R0
SYMATTR InstName E12
SYMATTR Value 0.5
SYMBOL e 1792 96 R0
SYMATTR InstName E13
SYMATTR Value 0.5
SYMBOL e 864 48 R0
SYMATTR InstName E14
SYMATTR Value 1
SYMBOL current 1248 368 R0
WINDOW 123 0 0 Left 2
WINDOW 39 0 0 Left 2
SYMATTR InstName I3
SYMATTR Value 200µ
SYMBOL e 2096 144 R0
SYMATTR InstName E15
SYMATTR Value 10000
SYMBOL e 528 48 R0
SYMATTR InstName E16
SYMATTR Value 1
SYMBOL cap 2464 160 R0
SYMATTR InstName C1
SYMATTR Value 2.317p
SYMBOL cap 2656 160 R0
SYMATTR InstName C2
SYMATTR Value 2.317p
SYMBOL nmos4 3568 224 R0
SYMATTR InstName M13
SYMATTR Value mynmos
SYMATTR Value2 l=0.5u w=4.05u m=4
SYMBOL nmos4 3920 224 M0
SYMATTR InstName M14
SYMATTR Value mynmos
SYMATTR Value2 l=0.5u w=4.05u m=4
SYMBOL pmos4 3664 -96 M0
SYMATTR InstName M15
SYMATTR Value mypmos
SYMATTR Value2 l=0.5u w=4.05u m=14
SYMBOL pmos4 3824 -96 R0
SYMATTR InstName M16
SYMATTR Value mypmos
SYMATTR Value2 l=0.5u w=4.05u m=14
SYMBOL e 4288 304 R0
SYMATTR InstName E17
SYMATTR Value 0.5
SYMBOL e 4288 160 R0
SYMATTR InstName E18
SYMATTR Value 0.5
SYMBOL e 3360 112 R0
SYMATTR InstName E19
SYMATTR Value 1
SYMBOL current 3744 432 R0
WINDOW 123 0 0 Left 2
WINDOW 39 0 0 Left 2
SYMATTR InstName I4
SYMATTR Value 200µ
SYMBOL e 4592 208 R0
SYMATTR InstName E20
SYMATTR Value 10000
SYMBOL e 3024 112 R0
SYMATTR InstName E21
SYMATTR Value 1
SYMBOL nmos4 5472 240 R0
SYMATTR InstName M17
SYMATTR Value mynmos
SYMATTR Value2 l=0.5u w=4.05u m=4
SYMBOL nmos4 5824 240 M0
SYMATTR InstName M18
SYMATTR Value mynmos
SYMATTR Value2 l=0.5u w=4.05u m=4
SYMBOL pmos4 5568 -80 M0
SYMATTR InstName M19
SYMATTR Value mypmos
SYMATTR Value2 l=0.5u w=4.05u m=14
SYMBOL pmos4 5728 -80 R0
SYMATTR InstName M20
SYMATTR Value mypmos
SYMATTR Value2 l=0.5u w=4.05u m=14
SYMBOL e 6192 320 R0
SYMATTR InstName E22
SYMATTR Value 0.5
SYMBOL e 6192 176 R0
SYMATTR InstName E23
SYMATTR Value 0.5
SYMBOL e 5264 128 R0
SYMATTR InstName E24
SYMATTR Value 1
SYMBOL current 5648 448 R0
WINDOW 123 0 0 Left 2
WINDOW 39 0 0 Left 2
SYMATTR InstName I5
SYMATTR Value 200µ
SYMBOL e 6496 224 R0
SYMATTR InstName E25
SYMATTR Value 10000
SYMBOL e 4928 128 R0
SYMATTR InstName E26
SYMATTR Value 1
SYMBOL nmos4 7376 256 R0
SYMATTR InstName M21
SYMATTR Value mynmos
SYMATTR Value2 l=0.5u w=4.05u m=4
SYMBOL nmos4 7728 256 M0
SYMATTR InstName M22
SYMATTR Value mynmos
SYMATTR Value2 l=0.5u w=4.05u m=4
SYMBOL pmos4 7472 -64 M0
SYMATTR InstName M23
SYMATTR Value mypmos
SYMATTR Value2 l=0.5u w=4.05u m=14
SYMBOL pmos4 7632 -64 R0
SYMATTR InstName M24
SYMATTR Value mypmos
SYMATTR Value2 l=0.5u w=4.05u m=14
SYMBOL e 8096 336 R0
SYMATTR InstName E27
SYMATTR Value 0.5
SYMBOL e 8096 192 R0
SYMATTR InstName E28
SYMATTR Value 0.5
SYMBOL e 7168 144 R0
SYMATTR InstName E29
SYMATTR Value 1
SYMBOL current 7552 464 R0
WINDOW 123 0 0 Left 2
WINDOW 39 0 0 Left 2
SYMATTR InstName I6
SYMATTR Value 200µ
SYMBOL e 8400 240 R0
SYMATTR InstName E30
SYMATTR Value 10000
SYMBOL e 6832 144 R0
SYMATTR InstName E31
SYMATTR Value 1
SYMBOL cap 8768 208 R0
SYMATTR InstName C3
SYMATTR Value 1.43225p
SYMBOL cap 8944 208 R0
SYMATTR InstName C4
SYMATTR Value 1.43225p
SYMBOL nmos4 9776 256 R0
SYMATTR InstName M25
SYMATTR Value mynmos
SYMATTR Value2 l=0.5u w=4.05u m=4
SYMBOL nmos4 10128 256 M0
SYMATTR InstName M26
SYMATTR Value mynmos
SYMATTR Value2 l=0.5u w=4.05u m=4
SYMBOL pmos4 9872 -64 M0
SYMATTR InstName M27
SYMATTR Value mypmos
SYMATTR Value2 l=0.5u w=4.05u m=14
SYMBOL pmos4 10032 -64 R0
SYMATTR InstName M28
SYMATTR Value mypmos
SYMATTR Value2 l=0.5u w=4.05u m=14
SYMBOL e 10496 336 R0
SYMATTR InstName E32
SYMATTR Value 0.5
SYMBOL e 10496 192 R0
SYMATTR InstName E33
SYMATTR Value 0.5
SYMBOL e 9568 144 R0
SYMATTR InstName E34
SYMATTR Value 1
SYMBOL current 9952 464 R0
WINDOW 123 0 0 Left 2
WINDOW 39 0 0 Left 2
SYMATTR InstName I7
SYMATTR Value 200µ
SYMBOL e 10800 240 R0
SYMATTR InstName E35
SYMATTR Value 10000
SYMBOL e 9232 144 R0
SYMATTR InstName E36
SYMATTR Value 1
SYMBOL nmos4 11680 272 R0
SYMATTR InstName M29
SYMATTR Value mynmos
SYMATTR Value2 l=0.5u w=4.05u m=4
SYMBOL nmos4 12032 272 M0
SYMATTR InstName M30
SYMATTR Value mynmos
SYMATTR Value2 l=0.5u w=4.05u m=4
SYMBOL pmos4 11776 -48 M0
SYMATTR InstName M31
SYMATTR Value mypmos
SYMATTR Value2 l=0.5u w=4.05u m=14
SYMBOL pmos4 11936 -48 R0
SYMATTR InstName M32
SYMATTR Value mypmos
SYMATTR Value2 l=0.5u w=4.05u m=14
SYMBOL e 12400 352 R0
SYMATTR InstName E37
SYMATTR Value 0.5
SYMBOL e 12400 208 R0
SYMATTR InstName E38
SYMATTR Value 0.5
SYMBOL e 11472 160 R0
SYMATTR InstName E39
SYMATTR Value 1
SYMBOL current 11856 480 R0
WINDOW 123 0 0 Left 2
WINDOW 39 0 0 Left 2
SYMATTR InstName I8
SYMATTR Value 200µ
SYMBOL e 12704 256 R0
SYMATTR InstName E40
SYMATTR Value 10000
SYMBOL e 11136 160 R0
SYMATTR InstName E41
SYMATTR Value 1
SYMBOL cap 12992 208 R0
SYMATTR InstName C5
SYMATTR Value 3.7492p
SYMBOL cap 13168 208 R0
SYMATTR InstName C6
SYMATTR Value 3.7492p
SYMBOL nmos4 13968 288 R0
SYMATTR InstName M33
SYMATTR Value mynmos
SYMATTR Value2 l=0.5u w=4.05u m=4
SYMBOL nmos4 14320 288 M0
SYMATTR InstName M34
SYMATTR Value mynmos
SYMATTR Value2 l=0.5u w=4.05u m=4
SYMBOL pmos4 14064 -32 M0
SYMATTR InstName M35
SYMATTR Value mypmos
SYMATTR Value2 l=0.5u w=4.05u m=14
SYMBOL pmos4 14224 -32 R0
SYMATTR InstName M36
SYMATTR Value mypmos
SYMATTR Value2 l=0.5u w=4.05u m=14
SYMBOL e 14688 368 R0
SYMATTR InstName E42
SYMATTR Value 0.5
SYMBOL e 14688 224 R0
SYMATTR InstName E43
SYMATTR Value 0.5
SYMBOL e 13760 176 R0
SYMATTR InstName E44
SYMATTR Value 1
SYMBOL current 14144 496 R0
WINDOW 123 0 0 Left 2
WINDOW 39 0 0 Left 2
SYMATTR InstName I9
SYMATTR Value 200µ
SYMBOL e 14992 272 R0
SYMATTR InstName E45
SYMATTR Value 10000
SYMBOL e 13424 176 R0
SYMATTR InstName E46
SYMATTR Value 1
SYMBOL voltage -2048 48 R0
WINDOW 123 0 0 Left 2
WINDOW 39 0 0 Left 2
SYMATTR InstName V1
SYMATTR Value 3.3
SYMBOL voltage -2288 48 R0
WINDOW 123 0 0 Left 2
WINDOW 39 0 0 Left 2
SYMATTR InstName V3
SYMATTR Value 1.6
SYMBOL nmos4 15952 320 R0
SYMATTR InstName M1
SYMATTR Value mynmos
SYMATTR Value2 l=0.5u w=4.05u m=4
SYMBOL nmos4 16304 320 M0
SYMATTR InstName M2
SYMATTR Value mynmos
SYMATTR Value2 l=0.5u w=4.05u m=4
SYMBOL pmos4 16048 0 M0
SYMATTR InstName M3
SYMATTR Value mypmos
SYMATTR Value2 l=0.5u w=4.05u m=14
SYMBOL pmos4 16208 0 R0
SYMATTR InstName M4
SYMATTR Value mypmos
SYMATTR Value2 l=0.5u w=4.05u m=14
SYMBOL e 16672 400 R0
SYMATTR InstName E1
SYMATTR Value 0.5
SYMBOL e 16672 256 R0
SYMATTR InstName E2
SYMATTR Value 0.5
SYMBOL e 15744 208 R0
SYMATTR InstName E3
SYMATTR Value 1
SYMBOL current 16128 528 R0
WINDOW 123 0 0 Left 2
WINDOW 39 0 0 Left 2
SYMATTR InstName I1
SYMATTR Value 200µ
SYMBOL e 16976 304 R0
SYMATTR InstName E4
SYMATTR Value 10000
SYMBOL e 15408 208 R0
SYMATTR InstName E5
SYMATTR Value 1
SYMBOL nmos4 17856 336 R0
SYMATTR InstName M37
SYMATTR Value mynmos
SYMATTR Value2 l=0.5u w=4.05u m=4
SYMBOL nmos4 18208 336 M0
SYMATTR InstName M38
SYMATTR Value mynmos
SYMATTR Value2 l=0.5u w=4.05u m=4
SYMBOL pmos4 17952 16 M0
SYMATTR InstName M39
SYMATTR Value mypmos
SYMATTR Value2 l=0.5u w=4.05u m=14
SYMBOL pmos4 18112 16 R0
SYMATTR InstName M40
SYMATTR Value mypmos
SYMATTR Value2 l=0.5u w=4.05u m=14
SYMBOL e 18576 416 R0
SYMATTR InstName E47
SYMATTR Value 0.5
SYMBOL e 18576 272 R0
SYMATTR InstName E48
SYMATTR Value 0.5
SYMBOL e 17648 224 R0
SYMATTR InstName E49
SYMATTR Value 1
SYMBOL current 18032 544 R0
WINDOW 123 0 0 Left 2
WINDOW 39 0 0 Left 2
SYMATTR InstName I10
SYMATTR Value 200µ
SYMBOL e 18880 320 R0
SYMATTR InstName E50
SYMATTR Value 10000
SYMBOL e 17312 224 R0
SYMATTR InstName E51
SYMATTR Value 1
SYMBOL nmos4 19760 352 R0
SYMATTR InstName M41
SYMATTR Value mynmos
SYMATTR Value2 l=0.5u w=4.05u m=4
SYMBOL nmos4 20112 352 M0
SYMATTR InstName M42
SYMATTR Value mynmos
SYMATTR Value2 l=0.5u w=4.05u m=4
SYMBOL pmos4 19856 32 M0
SYMATTR InstName M43
SYMATTR Value mypmos
SYMATTR Value2 l=0.5u w=4.05u m=14
SYMBOL pmos4 20016 32 R0
SYMATTR InstName M44
SYMATTR Value mypmos
SYMATTR Value2 l=0.5u w=4.05u m=14
SYMBOL e 20480 432 R0
SYMATTR InstName E52
SYMATTR Value 0.5
SYMBOL e 20480 288 R0
SYMATTR InstName E53
SYMATTR Value 0.5
SYMBOL e 19552 240 R0
SYMATTR InstName E54
SYMATTR Value 1
SYMBOL current 19936 560 R0
WINDOW 123 0 0 Left 2
WINDOW 39 0 0 Left 2
SYMATTR InstName I11
SYMATTR Value 200µ
SYMBOL e 20784 336 R0
SYMATTR InstName E55
SYMATTR Value 10000
SYMBOL e 19216 240 R0
SYMATTR InstName E56
SYMATTR Value 1
SYMBOL cap 21152 304 R0
SYMATTR InstName C7
SYMATTR Value 3.75p
SYMBOL cap 21328 304 R0
SYMATTR InstName C8
SYMATTR Value 3.75p
SYMBOL nmos4 22160 352 R0
SYMATTR InstName M45
SYMATTR Value mynmos
SYMATTR Value2 l=0.5u w=4.05u m=4
SYMBOL nmos4 22512 352 M0
SYMATTR InstName M46
SYMATTR Value mynmos
SYMATTR Value2 l=0.5u w=4.05u m=4
SYMBOL pmos4 22256 32 M0
SYMATTR InstName M47
SYMATTR Value mypmos
SYMATTR Value2 l=0.5u w=4.05u m=14
SYMBOL pmos4 22416 32 R0
SYMATTR InstName M48
SYMATTR Value mypmos
SYMATTR Value2 l=0.5u w=4.05u m=14
SYMBOL e 22880 432 R0
SYMATTR InstName E57
SYMATTR Value 0.5
SYMBOL e 22880 288 R0
SYMATTR InstName E58
SYMATTR Value 0.5
SYMBOL e 21952 240 R0
SYMATTR InstName E59
SYMATTR Value 1
SYMBOL current 22336 560 R0
WINDOW 123 0 0 Left 2
WINDOW 39 0 0 Left 2
SYMATTR InstName I12
SYMATTR Value 200µ
SYMBOL e 23184 336 R0
SYMATTR InstName E60
SYMATTR Value 10000
SYMBOL e 21616 240 R0
SYMATTR InstName E61
SYMATTR Value 1
SYMBOL nmos4 24064 368 R0
SYMATTR InstName M49
SYMATTR Value mynmos
SYMATTR Value2 l=0.5u w=4.05u m=4
SYMBOL nmos4 24416 368 M0
SYMATTR InstName M50
SYMATTR Value mynmos
SYMATTR Value2 l=0.5u w=4.05u m=4
SYMBOL pmos4 24160 48 M0
SYMATTR InstName M51
SYMATTR Value mypmos
SYMATTR Value2 l=0.5u w=4.05u m=14
SYMBOL pmos4 24320 48 R0
SYMATTR InstName M52
SYMATTR Value mypmos
SYMATTR Value2 l=0.5u w=4.05u m=14
SYMBOL e 24784 448 R0
SYMATTR InstName E62
SYMATTR Value 0.5
SYMBOL e 24784 304 R0
SYMATTR InstName E63
SYMATTR Value 0.5
SYMBOL e 23856 256 R0
SYMATTR InstName E64
SYMATTR Value 1
SYMBOL current 24240 576 R0
WINDOW 123 0 0 Left 2
WINDOW 39 0 0 Left 2
SYMATTR InstName I13
SYMATTR Value 200µ
SYMBOL e 25088 352 R0
SYMATTR InstName E65
SYMATTR Value 10000
SYMBOL e 23520 256 R0
SYMATTR InstName E66
SYMATTR Value 1
SYMBOL cap 25376 304 R0
SYMATTR InstName C9
SYMATTR Value 1.432p
SYMBOL cap 25552 304 R0
SYMATTR InstName C10
SYMATTR Value 1.432p
SYMBOL nmos4 26352 384 R0
SYMATTR InstName M53
SYMATTR Value mynmos
SYMATTR Value2 l=0.5u w=4.05u m=4
SYMBOL nmos4 26704 384 M0
SYMATTR InstName M54
SYMATTR Value mynmos
SYMATTR Value2 l=0.5u w=4.05u m=4
SYMBOL pmos4 26448 64 M0
SYMATTR InstName M55
SYMATTR Value mypmos
SYMATTR Value2 l=0.5u w=4.05u m=14
SYMBOL pmos4 26608 64 R0
SYMATTR InstName M56
SYMATTR Value mypmos
SYMATTR Value2 l=0.5u w=4.05u m=14
SYMBOL e 27072 464 R0
SYMATTR InstName E67
SYMATTR Value 0.5
SYMBOL e 27072 320 R0
SYMATTR InstName E68
SYMATTR Value 0.5
SYMBOL e 26144 272 R0
SYMATTR InstName E69
SYMATTR Value 1
SYMBOL current 26528 592 R0
WINDOW 123 0 0 Left 2
WINDOW 39 0 0 Left 2
SYMATTR InstName I14
SYMATTR Value 200µ
SYMBOL e 27376 368 R0
SYMATTR InstName E70
SYMATTR Value 10000
SYMBOL e 25808 272 R0
SYMATTR InstName E71
SYMATTR Value 1
TEXT -2224 -576 Left 2 !.inc I:\\LTSpice\\my_mos_model.txt
TEXT -2224 -504 Left 2 !.ac dec 1000 1 1G

The netlist it stands for:
* GmCMaxFlatTrans.asc
V5 Vinp 0 AC 1
E6 Vinm 0 Vinp 0 -1
M5 Vlpm N002 N057 0 mynmos l=0.5u w=4.05u m=4
M6 Vlpp N004 N057 0 mynmos l=0.5u w=4.05u m=4
M7 Vdd N001 Vlpm Vdd mypmos l=0.5u w=4.05u m=14
M8 Vdd N001 Vlpp Vdd mypmos l=0.5u w=4.05u m=14
E7 N051 0 Vlpm 0 0.5
E8 N013 N051 Vlpp 0 0.5
E9 N004 Vcm1 Vinm 0 1
I2 N057 0 200µ
E10 N001 0 N013 Vcm1 10000
E11 N002 Vcm1 Vinp 0 1
M9 Vlpm N005 N060 0 mynmos l=0.5u w=4.05u m=4
M10 Vlpp N006 N060 0 mynmos l=0.5u w=4.05u m=4
M11 Vdd N003 Vlpm Vdd mypmos l=0.5u w=4.05u m=14
M12 Vdd N003 Vlpp Vdd mypmos l=0.5u w=4.05u m=14
E12 N054 0 Vlpm 0 0.5
E13 N021 N054 Vlpp 0 0.5
E14 N006 0 Vlpp 0 1
I3 N060 0 200µ
E15 N003 0 N021 Vcm1 10000
E16 N005 0 Vlpm 0 1
C1 Vlpp 0 2.317p
C2 Vlpm 0 2.317p
M13 V1p N008 N065 0 mynmos l=0.5u w=4.05u m=4
M14 V1m N014 N065 0 mynmos l=0.5u w=4.05u m=4
M15 Vdd N007 V1p Vdd mypmos l=0.5u w=4.05u m=14
M16 Vdd N007 V1m Vdd mypmos l=0.5u w=4.05u m=14
E17 N061 0 V1p 0 0.5
E18 N033 N061 V1m 0 0.5
E19 N014 0 Vlpp 0 1
I4 N065 0 200µ
E20 N007 0 N033 Vcm1 10000
E21 N008 0 Vlpm 0 1
M17 V1p N010 N067 0 mynmos l=0.5u w=4.05u m=4
M18 V1m N018 N067 0 mynmos l=0.5u w=4.05u m=4
M19 Vdd N009 V1p Vdd mypmos l=0.5u w=4.05u m=14
M20 Vdd N009 V1m Vdd mypmos l=0.5u w=4.05u m=14
E22 N062 0 V1p 0 0.5
E23 N038 N062 V1m 0 0.5
E24 N018 0 V1m 0 1
I5 N067 0 200µ
E25 N009 0 N038 Vcm1 10000
E26 N010 0 V1p 0 1
M21 Vlm N015 N069 0 mynmos l=0.5u w=4.05u m=4
M22 Vlp N022 N069 0 mynmos l=0.5u w=4.05u m=4
M23 Vdd N011 Vlm Vdd mypmos l=0.5u w=4.05u m=14
M24 Vdd N011 Vlp Vdd mypmos l=0.5u w=4.05u m=14
E27 N063 0 Vlm 0 0.5
E28 N042 N063 Vlp 0 0.5
E29 N022 0 V1m 0 1
I6 N069 0 200µ
E30 N011 0 N042 Vcm1 10000
E31 N015 0 V1p 0 1
C3 Vlp 0 1.43225p
C4 Vlm 0 1.43225p
M25 V1m N016 N070 0 mynmos l=0.5u w=4.05u m=4
M26 V1p N023 N070 0 mynmos l=0.5u w=4.05u m=4
M27 Vdd N012 V1m Vdd mypmos l=0.5u w=4.05u m=14
M28 Vdd N012 V1p Vdd mypmos l=0.5u w=4.05u m=14
E32 N064 0 V1m 0 0.5
E33 N043 N064 V1p 0 0.5
E34 N023 0 Vlp 0 1
I7 N070 0 200µ
E35 N012 0 N043 Vcm1 10000
E36 N016 0 Vlm 0 1
M29 Vlpfp N019 N071 0 mynmos l=0.5u w=4.05u m=4
M30 Vlpfm N025 N071 0 mynmos l=0.5u w=4.05u m=4
M31 Vdd N017 Vlpfp Vdd mypmos l=0.5u w=4.05u m=14
M32 Vdd N017 Vlpfm Vdd mypmos l=0.5u w=4.05u m=14
E37 N066 0 Vlpfp 0 0.5
E38 N047 N066 Vlpfm 0 0.5
E39 N025 0 Vlp 0 1
I8 N071 0 200µ
E40 N017 0 N047 Vcm1 10000
E41 N019 0 Vlm 0 1
C5 Vlpfp 0 3.7492p
C6 Vlpfm 0 3.7492p
M33 Vlp N024 N073 0 mynmos l=0.5u w=4.05u m=4
M34 Vlm N027 N073 0 mynmos l=0.5u w=4.05u m=4
M35 Vdd N020 Vlp Vdd mypmos l=0.5u w=4.05u m=14
M36 Vdd N020 Vlm Vdd mypmos l=0.5u w=4.05u m=14
E42 N068 0 Vlp 0 0.5
E43 N049 N068 Vlm 0 0.5
E44 N027 0 Vlpfm 0 1
I9 N073 0 200µ
E45 N020 0 N049 Vcm1 10000
E46 N024 0 Vlpfp 0 1
V1 Vdd 0 3.3
V3 Vcm1 0 1.6
M1 V2m N028 N077 0 mynmos l=0.5u w=4.05u m=4
M2 V2p N034 N077 0 mynmos l=0.5u w=4.05u m=4
M3 Vdd N026 V2m Vdd mypmos l=0.5u w=4.05u m=14
M4 Vdd N026 V2p Vdd mypmos l=0.5u w=4.05u m=14
E1 N072 0 V2m 0 0.5
E2 N052 N072 V2p 0 0.5
E3 N034 0 Vlpfm 0 1
I1 N077 0 200µ
E4 N026 0 N052 Vcm1 10000
E5 N028 0 Vlpfp 0 1
M37 V2m N030 N079 0 mynmos l=0.5u w=4.05u m=4
M38 V2p N039 N079 0 mynmos l=0.5u w=4.05u m=4
M39 Vdd N029 V2m Vdd mypmos l=0.5u w=4.05u m=14
M40 Vdd N029 V2p Vdd mypmos l=0.5u w=4.05u m=14
E47 N074 0 V2m 0 0.5
E48 N053 N074 V2p 0 0.5
E49 N039 0 V2p 0 1
I10 N079 0 200µ
E50 N029 0 N053 Vcm1 10000
E51 N030 0 V2m 0 1
M41 Vap N035 N081 0 mynmos l=0.5u w=4.05u m=4
M42 Vam N044 N081 0 mynmos l=0.5u w=4.05u m=4
M43 Vdd N031 Vap Vdd mypmos l=0.5u w=4.05u m=14
M44 Vdd N031 Vam Vdd mypmos l=0.5u w=4.05u m=14
E52 N075 0 Vap 0 0.5
E53 N055 N075 Vam 0 0.5
E54 N044 0 V2p 0 1
I11 N081 0 200µ
E55 N031 0 N055 Vcm1 10000
E56 N035 0 V2m 0 1
C7 Vap 0 3.75p
C8 Vam 0 3.75p
M45 V2p N036 N082 0 mynmos l=0.5u w=4.05u m=4
M46 V2m N045 N082 0 mynmos l=0.5u w=4.05u m=4
M47 Vdd N032 V2p Vdd mypmos l=0.5u w=4.05u m=14
M48 Vdd N032 V2m Vdd mypmos l=0.5u w=4.05u m=14
E57 N076 0 V2p 0 0.5
E58 N056 N076 V2m 0 0.5
E59 N045 0 Vam 0 1
I12 N082 0 200µ
E60 N032 0 N056 Vcm1 10000
E61 N036 0 Vap 0 1
M49 Vbm N040 N083 0 mynmos l=0.5u w=4.05u m=4
M50 Vbp N048 N083 0 mynmos l=0.5u w=4.05u m=4
M51 Vdd N037 Vbm Vdd mypmos l=0.5u w=4.05u m=14
M52 Vdd N037 Vbp Vdd mypmos l=0.5u w=4.05u m=14
E62 N078 0 Vbm 0 0.5
E63 N058 N078 Vbp 0 0.5
E64 N048 0 Vam 0 1
I13 N083 0 200µ
E65 N037 0 N058 Vcm1 10000
E66 N040 0 Vap 0 1
C9 Vbp 0 1.432p
C10 Vbm 0 1.432p
M53 Vam N046 N084 0 mynmos l=0.5u w=4.05u m=4
M54 Vap N050 N084 0 mynmos l=0.5u w=4.05u m=4
M55 Vdd N041 Vam Vdd mypmos l=0.5u w=4.05u m=14
M56 Vdd N041 Vap Vdd mypmos l=0.5u w=4.05u m=14
E67 N080 0 Vam 0 0.5
E68 N059 N080 Vap 0 0.5
E69 N050 0 Vbp 0 1
I14 N084 0 200µ
E70 N041 0 N059 Vcm1 10000
E71 N046 0 Vbm 0 1
.model NMOS NMOS
.model PMOS PMOS
.lib standard.mos
.inc I:\LTSpice\my_mos_model.txt
.ac dec 1000 1 1G
.backanno
.end

* Results of the author's LTspice run, read from the files saved beside the schematic
* Operating Point, zero values left out:
*   V(vlpm) = 1.6 V
*   V(n002) = 1.6 V
*   V(n057) = 525.3 mV
*   V(vlpp) = 1.6 V
*   V(n004) = 1.6 V
*   V(vdd) = 3.3 V
*   V(n001) = 2.344 V
*   V(n051) = 800.1 mV
*   V(n013) = 1.6 V
*   V(vcm1) = 1.6 V
*   V(n005) = 1.6 V
*   V(n060) = 525.5 mV
*   V(n006) = 1.6 V
*   V(n003) = 2.344 V
*   V(n054) = 800.1 mV
*   V(n021) = 1.6 V
*   V(v1p) = 1.6 V
*   V(n008) = 1.6 V
*   V(n065) = 525.5 mV
*   V(v1m) = 1.6 V
*   V(n014) = 1.6 V
*   V(n007) = 2.344 V
*   V(n061) = 800.1 mV
*   V(n033) = 1.6 V
*   V(n010) = 1.6 V
*   V(n067) = 525.5 mV
*   V(n018) = 1.6 V
*   V(n009) = 2.344 V
*   V(n062) = 800.1 mV
*   V(n038) = 1.6 V
*   V(vlm) = 1.6 V
*   V(n015) = 1.6 V
*   V(n069) = 525.5 mV
*   V(vlp) = 1.6 V
*   V(n022) = 1.6 V
*   V(n011) = 2.344 V
*   V(n063) = 800.1 mV
*   V(n042) = 1.6 V
*   V(n016) = 1.6 V
*   V(n070) = 525.5 mV
*   V(n023) = 1.6 V
*   V(n012) = 2.344 V
*   V(n064) = 800.1 mV
*   V(n043) = 1.6 V
*   V(vlpfp) = 1.6 V
*   V(n019) = 1.6 V
*   V(n071) = 525.5 mV
*   V(vlpfm) = 1.6 V
*   V(n025) = 1.6 V
*   V(n017) = 2.344 V
*   V(n066) = 800.1 mV
*   V(n047) = 1.6 V
*   V(n024) = 1.6 V
*   V(n073) = 525.5 mV
*   V(n027) = 1.6 V
*   V(n020) = 2.344 V
*   V(n068) = 800.1 mV
*   V(n049) = 1.6 V
*   V(v2m) = 1.6 V
*   V(n028) = 1.6 V
*   V(n077) = 525.5 mV
*   V(v2p) = 1.6 V
*   V(n034) = 1.6 V
*   V(n026) = 2.344 V
*   V(n072) = 800.1 mV
*   V(n052) = 1.6 V
*   V(n030) = 1.6 V
*   V(n079) = 525.5 mV
*   V(n039) = 1.6 V
*   V(n029) = 2.344 V
*   V(n074) = 800.1 mV
*   V(n053) = 1.6 V
*   V(vap) = 1.6 V
*   V(n035) = 1.6 V
*   V(n081) = 525.5 mV
*   V(vam) = 1.6 V
*   V(n044) = 1.6 V
*   V(n031) = 2.344 V
*   V(n075) = 800.1 mV
*   V(n055) = 1.6 V
*   V(n036) = 1.6 V
*   V(n082) = 525.5 mV
*   V(n045) = 1.6 V
*   V(n032) = 2.344 V
*   V(n076) = 800.1 mV
*   V(n056) = 1.6 V
*   V(vbm) = 1.6 V
*   V(n040) = 1.6 V
*   V(n083) = 525.5 mV
*   V(vbp) = 1.6 V
*   V(n048) = 1.6 V
*   V(n037) = 2.344 V
*   V(n078) = 800.1 mV
*   V(n058) = 1.6 V
*   V(n046) = 1.6 V
*   V(n084) = 525.5 mV
*   V(n050) = 1.6 V
*   V(n041) = 2.344 V
*   V(n080) = 800.1 mV
*   V(n059) = 1.6 V
*   Id(M56) = 100 µA
*   Ib(M56) = 23.94 pA
*   Is(M56) = -100 µA
*   Id(M55) = 100 µA
*   Ib(M55) = 23.94 pA
*   Is(M55) = -100 µA
*   Id(M52) = 100 µA
*   Ib(M52) = 23.94 pA
*   Is(M52) = -100 µA
*   Id(M51) = 100 µA
*   Ib(M51) = 23.94 pA
*   Is(M51) = -100 µA
*   Id(M48) = 100 µA
*   Ib(M48) = 23.94 pA
*   Is(M48) = -100 µA
*   Id(M47) = 100 µA
*   Ib(M47) = 23.94 pA
*   Is(M47) = -100 µA
*   Id(M44) = 100 µA
*   Ib(M44) = 23.94 pA
*   Is(M44) = -100 µA
*   Id(M43) = 100 µA
*   Ib(M43) = 23.94 pA
*   Is(M43) = -100 µA
*   Id(M40) = 100 µA
*   Ib(M40) = 23.94 pA
*   Is(M40) = -100 µA
*   Id(M39) = 100 µA
*   Ib(M39) = 23.94 pA
*   Is(M39) = -100 µA
*   Id(M4) = 100 µA
*   Ib(M4) = 23.94 pA
*   Is(M4) = -100 µA
*   Id(M3) = 100 µA
*   Ib(M3) = 23.94 pA
*   Is(M3) = -100 µA
*   Id(M36) = 100 µA
*   Ib(M36) = 23.94 pA
*   Is(M36) = -100 µA
*   Id(M35) = 100 µA
*   Ib(M35) = 23.94 pA
*   Is(M35) = -100 µA
*   Id(M32) = 100 µA
*   Ib(M32) = 23.94 pA
*   Is(M32) = -100 µA
*   Id(M31) = 100 µA
*   Ib(M31) = 23.94 pA
*   Is(M31) = -100 µA
*   Id(M28) = 100 µA
*   Ib(M28) = 23.94 pA
*   Is(M28) = -100 µA
*   Id(M27) = 100 µA
*   Ib(M27) = 23.94 pA
*   Is(M27) = -100 µA
*   Id(M24) = 100 µA
*   Ib(M24) = 23.94 pA
*   Is(M24) = -100 µA
*   Id(M23) = 100 µA
*   Ib(M23) = 23.94 pA
*   Is(M23) = -100 µA
*   Id(M20) = 100 µA
*   Ib(M20) = 23.94 pA
*   Is(M20) = -100 µA
*   Id(M19) = 100 µA
*   Ib(M19) = 23.94 pA
*   Is(M19) = -100 µA
*   Id(M16) = 100 µA
*   Ib(M16) = 23.94 pA
*   Is(M16) = -100 µA
*   Id(M15) = 100 µA
*   Ib(M15) = 23.94 pA
*   Is(M15) = -100 µA
*   Id(M12) = 100 µA
*   Ib(M12) = 23.94 pA
*   Is(M12) = -100 µA
*   Id(M11) = 100 µA
*   Ib(M11) = 23.94 pA
*   Is(M11) = -100 µA
*   Id(M8) = 100 µA
*   Ib(M8) = 23.94 pA
*   Is(M8) = -100 µA
*   Id(M7) = 100 µA
*   Ib(M7) = 23.94 pA
*   Is(M7) = -100 µA
*   Id(M54) = 100 µA
*   Ib(M54) = -8.583 pA
*   Is(M54) = -100 µA
*   Id(M53) = 100 µA
*   Ib(M53) = -8.583 pA
*   Is(M53) = -100 µA
*   Id(M50) = 100 µA
*   Ib(M50) = -8.583 pA
*   Is(M50) = -100 µA
*   Id(M49) = 100 µA
*   Ib(M49) = -8.583 pA
*   Is(M49) = -100 µA
*   Id(M46) = 100 µA
*   Ib(M46) = -8.583 pA
*   Is(M46) = -100 µA
*   Id(M45) = 100 µA
*   Ib(M45) = -8.583 pA
*   Is(M45) = -100 µA
*   Id(M42) = 100 µA
*   Ib(M42) = -8.583 pA
*   Is(M42) = -100 µA
*   Id(M41) = 100 µA
*   Ib(M41) = -8.583 pA
*   Is(M41) = -100 µA
*   Id(M38) = 100 µA
*   Ib(M38) = -8.583 pA
*   Is(M38) = -100 µA
*   Id(M37) = 100 µA
*   Ib(M37) = -8.583 pA
*   Is(M37) = -100 µA
*   Id(M2) = 100 µA
*   Ib(M2) = -8.583 pA
*   Is(M2) = -100 µA
*   Id(M1) = 100 µA
*   Ib(M1) = -8.583 pA
*   Is(M1) = -100 µA
*   Id(M34) = 100 µA
*   Ib(M34) = -8.583 pA
*   Is(M34) = -100 µA
*   Id(M33) = 100 µA
*   Ib(M33) = -8.583 pA
*   Is(M33) = -100 µA
*   Id(M30) = 100 µA
*   Ib(M30) = -8.583 pA
*   Is(M30) = -100 µA
*   Id(M29) = 100 µA
*   Ib(M29) = -8.583 pA
*   Is(M29) = -100 µA
*   Id(M26) = 100 µA
*   Ib(M26) = -8.583 pA
*   Is(M26) = -100 µA
*   Id(M25) = 100 µA
*   Ib(M25) = -8.583 pA
*   Is(M25) = -100 µA
*   Id(M22) = 100 µA
*   Ib(M22) = -8.583 pA
*   Is(M22) = -100 µA
*   Id(M21) = 100 µA
*   Ib(M21) = -8.583 pA
*   Is(M21) = -100 µA
*   Id(M18) = 100 µA
*   Ib(M18) = -8.583 pA
*   Is(M18) = -100 µA
*   Id(M17) = 100 µA
*   Ib(M17) = -8.583 pA
*   Is(M17) = -100 µA
*   Id(M14) = 100 µA
*   Ib(M14) = -8.583 pA
*   Is(M14) = -100 µA
*   Id(M13) = 100 µA
*   Ib(M13) = -8.583 pA
*   Is(M13) = -100 µA
*   Id(M10) = 100 µA
*   Ib(M10) = -8.583 pA
*   Is(M10) = -100 µA
*   Id(M9) = 100 µA
*   Ib(M9) = -8.583 pA
*   Is(M9) = -100 µA
*   Id(M6) = 100 µA
*   Ib(M6) = -8.582 pA
*   Is(M6) = -100 µA
*   Id(M5) = 100 µA
*   Ib(M5) = -8.582 pA
*   Is(M5) = -100 µA
*   I(I14) = 200 µA
*   I(I13) = 200 µA
*   I(I12) = 200 µA
*   I(I11) = 200 µA
*   I(I10) = 200 µA
*   I(I1) = 200 µA
*   I(I9) = 200 µA
*   I(I8) = 200 µA
*   I(I7) = 200 µA
*   I(I6) = 200 µA
*   I(I5) = 200 µA
*   I(I4) = 200 µA
*   I(I3) = 200 µA
*   I(I2) = 200 µA
*   I(V1) = -2.8 mA